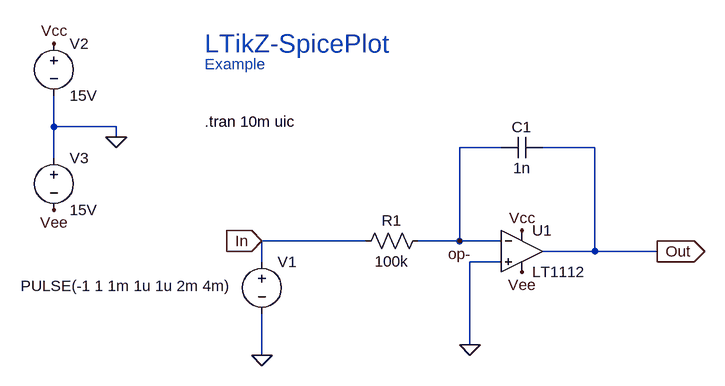
[diagram p0: schematic opamp.asc]
opamp.asc, the LTspice schematic file:
Version 4
SHEET 1 880 680
WIRE -624 -48 -624 -96
WIRE -528 -48 -624 -48
WIRE -528 -32 -528 -48
WIRE 64 -16 0 -16
WIRE 208 -16 128 -16
WIRE -624 0 -624 -48
WIRE -144 128 -304 128
WIRE 0 128 0 -16
WIRE 0 128 -64 128
WIRE 64 128 0 128
WIRE 208 144 208 -16
WIRE 208 144 128 144
WIRE 304 144 208 144
WIRE -304 160 -304 128
WIRE 64 160 16 160
WIRE 16 288 16 160
WIRE -304 304 -304 240
FLAG 16 288 0
FLAG -624 -176 Vcc
FLAG -624 80 Vee
FLAG 96 112 Vcc
FLAG 96 176 Vee
FLAG -304 304 0
FLAG -304 128 In
IOPIN -304 128 In
FLAG 304 144 Out
IOPIN 304 144 Out
FLAG 0 128 op-
FLAG -528 -32 0
SYMBOL cap 128 -32 R90
WINDOW 0 0 32 VBottom 2
WINDOW 3 32 32 VTop 2
SYMATTR InstName C1
SYMATTR Value 1n
SYMBOL res -48 112 R90
WINDOW 0 0 56 VBottom 2
WINDOW 3 32 56 VTop 2
SYMATTR InstName R1
SYMATTR Value 100k
SYMBOL voltage -304 144 R0
WINDOW 123 0 0 Left 0
WINDOW 39 0 0 Left 0
WINDOW 3 -371 53 Left 2
SYMATTR Value PULSE(-1 1 1m 1u 1u 2m 4m)
SYMATTR InstName V1
SYMBOL voltage -624 -192 R0
WINDOW 123 0 0 Left 0
WINDOW 39 0 0 Left 0
SYMATTR InstName V2
SYMATTR Value 15V
SYMBOL voltage -624 -16 R0
WINDOW 123 0 0 Left 0
WINDOW 39 0 0 Left 0
SYMATTR InstName V3
SYMATTR Value 15V
SYMBOL OpAmps\\LT1112 96 80 R0
SYMATTR InstName U1
TEXT -392 -56 Left 2 !.tran 10m uic
TEXT -392 -176 Left 4 ;LTikZ-SpicePlot
TEXT -392 -144 Left 2 ;Example

The netlist it stands for:
* opamp.asc
C1 Out op- 1n
R1 op- In 100k
V1 In 0 PULSE(-1 1 1m 1u 1u 2m 4m)
V2 Vcc 0 15V
V3 0 Vee 15V
XU1 0 op- Vcc Vee Out LT1112  ; pins In+ In- V+ V- OUT
.tran 10m uic
* LTikZ-SpicePlot
* Example
.lib LTC.lib
.backanno
.end

* Results of the author's LTspice run, read from the files saved beside the schematic
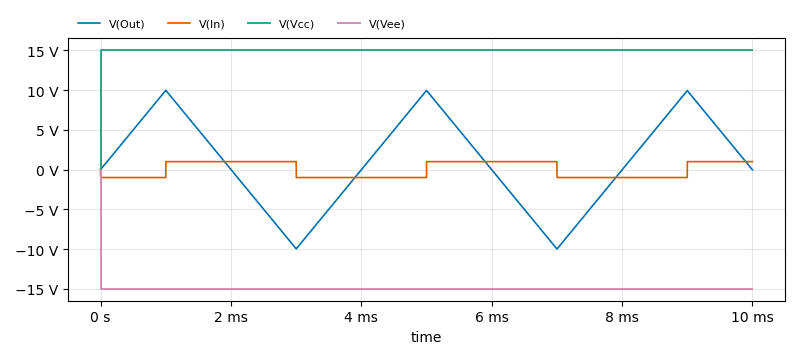
[diagram p1: Transient Analysis of opamp.asc, plotted from the saved traces]
* Transient Analysis, 1 run:
*   V(Out): min -9.997 V, max 9.977 V, average 982.3 mV, rms 8.996 V, last -27.25 mV
*   V(In): min -1 V, max 1 V, average 300 µV, rms 999.8 mV, last 1 V
*   V(Vcc): min 0 V, max 15 V, average 15 V, rms 15 V, last 15 V
*   V(Vee): min -15 V, max 0 V, average -15 V, rms 15 V, last -15 V